# Altium schematic sheet 0039_GPP_C_D_E.SchDoc
size A3
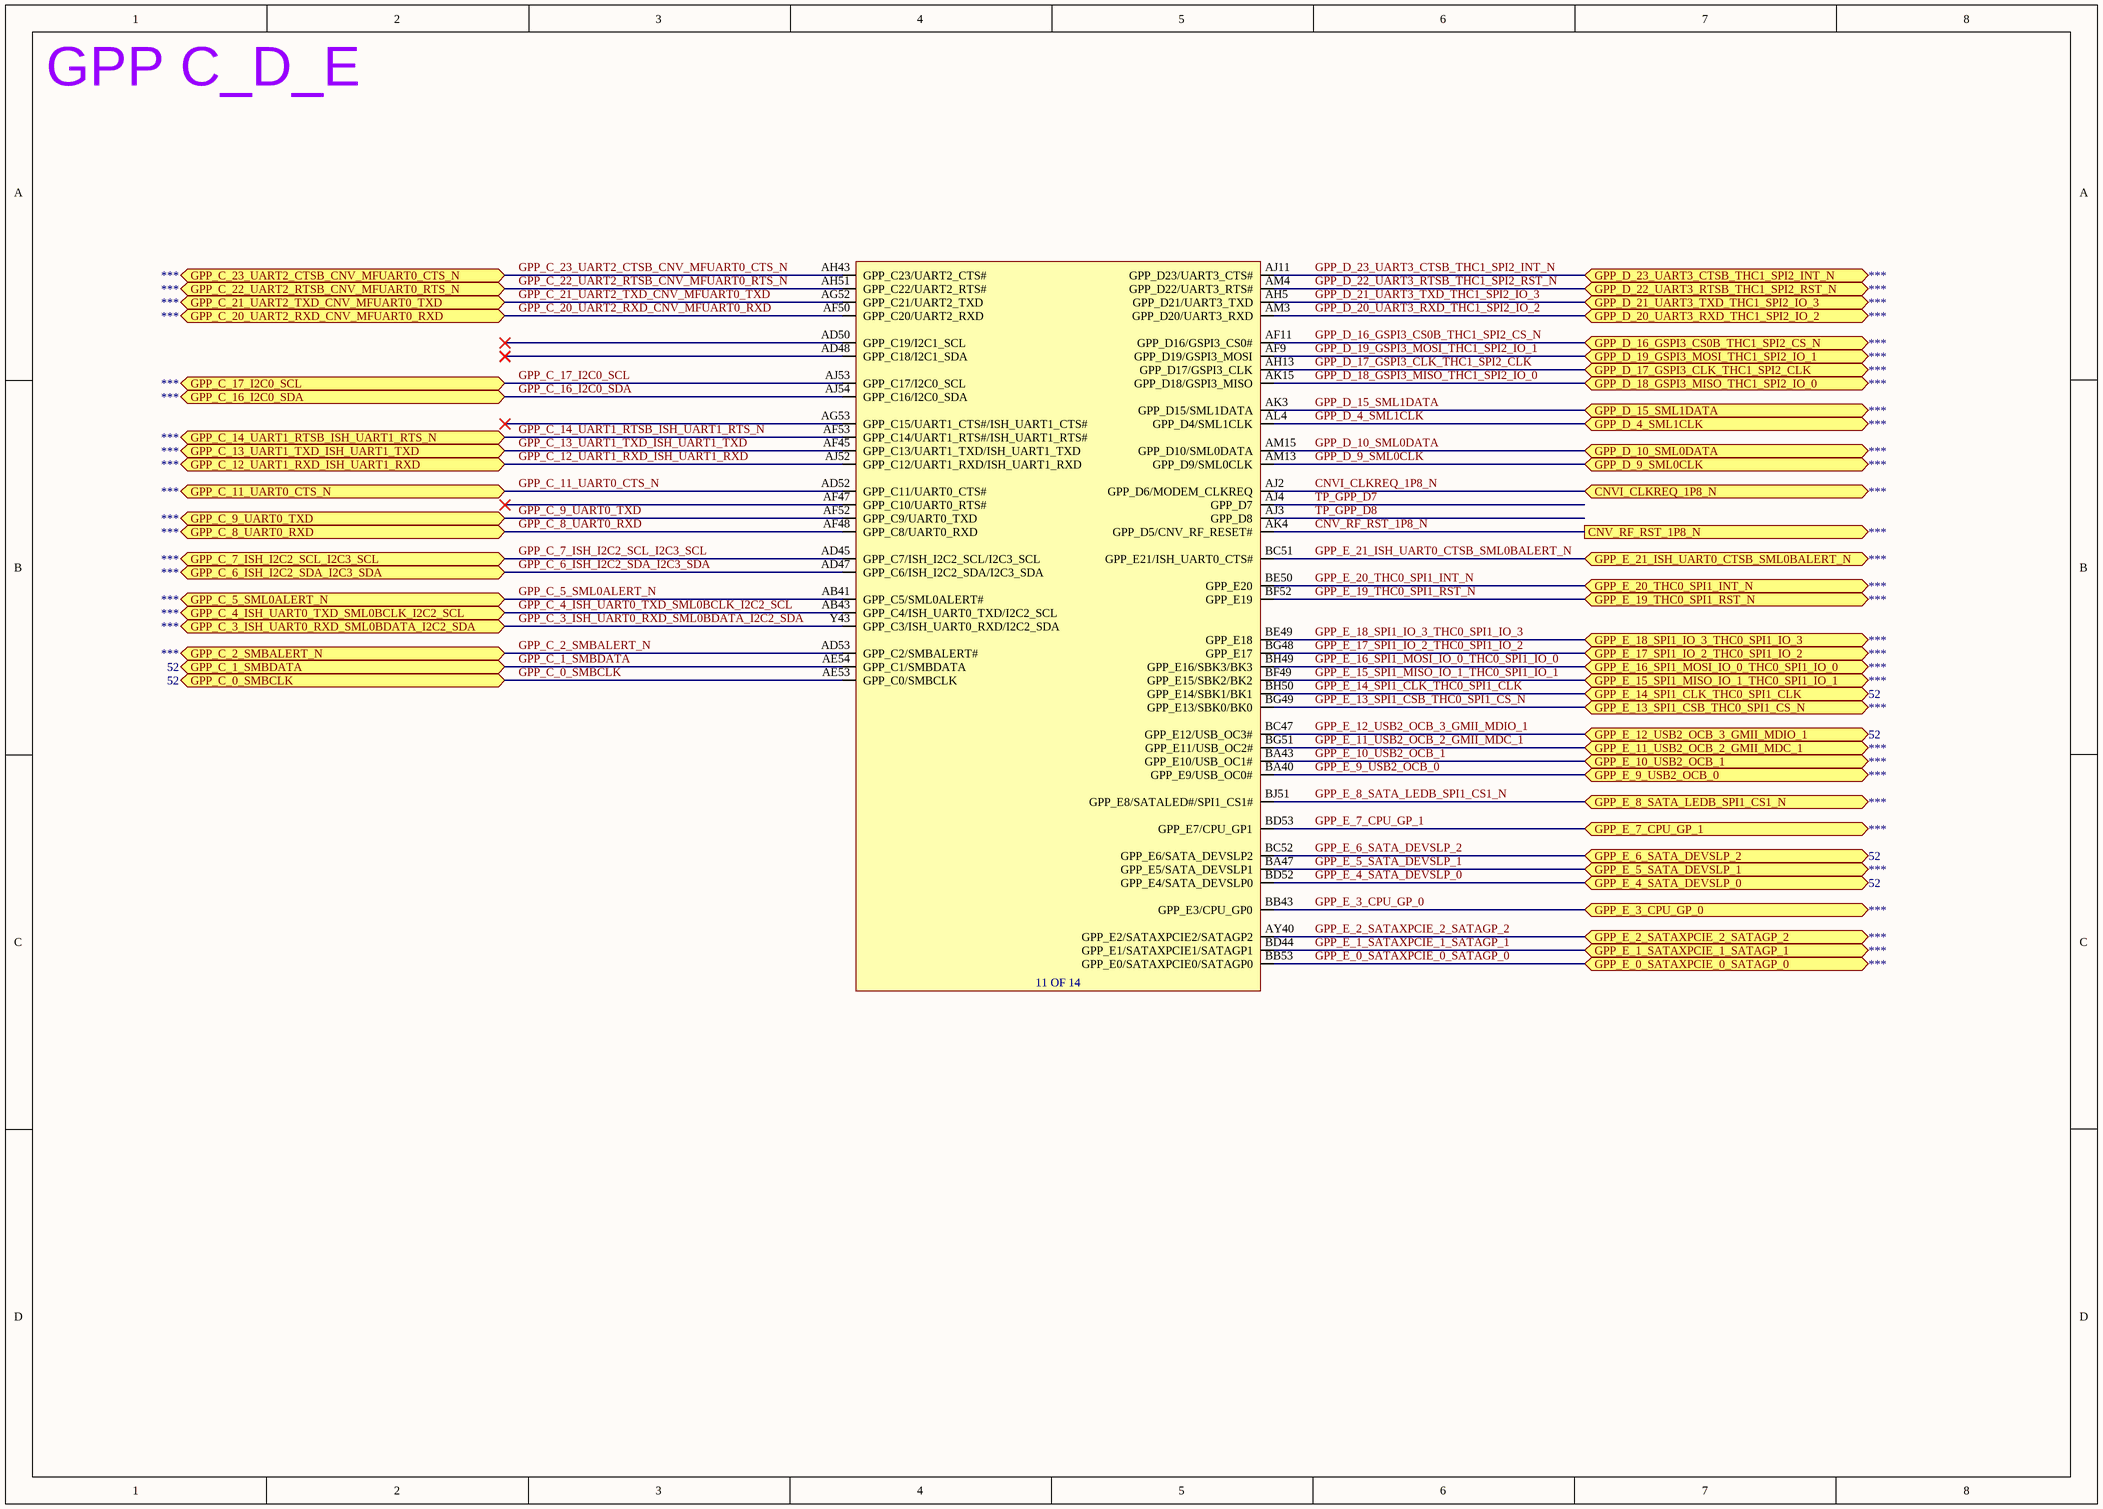
[diagram p0: 0039_GPP_C_D_E.SchDoc]

## Parts
U23601  C_RPL_S_PCH_EXT  (value not drawn)  (part K of 14)

## Ports
CNV_RF_RST_1P8_N (out), CNVI_CLKREQ_1P8_N (bidir), GPP_C_0_SMBCLK (bidir), GPP_C_1_SMBDATA (bidir), GPP_C_2_SMBALERT_N (bidir), GPP_C_3_ISH_UART0_RXD_SML0BDATA_I2C2_SDA (bidir), GPP_C_4_ISH_UART0_TXD_SML0BCLK_I2C2_SCL (bidir), GPP_C_5_SML0ALERT_N (bidir), GPP_C_6_ISH_I2C2_SDA_I2C3_SDA (bidir), GPP_C_7_ISH_I2C2_SCL_I2C3_SCL (bidir), GPP_C_8_UART0_RXD (bidir), GPP_C_9_UART0_TXD (bidir), GPP_C_11_UART0_CTS_N (bidir), GPP_C_12_UART1_RXD_ISH_UART1_RXD (bidir), GPP_C_13_UART1_TXD_ISH_UART1_TXD (bidir), GPP_C_14_UART1_RTSB_ISH_UART1_RTS_N (bidir), GPP_C_16_I2C0_SDA (bidir), GPP_C_17_I2C0_SCL (bidir), GPP_C_20_UART2_RXD_CNV_MFUART0_RXD (bidir), GPP_C_21_UART2_TXD_CNV_MFUART0_TXD (bidir), GPP_C_22_UART2_RTSB_CNV_MFUART0_RTS_N (bidir), GPP_C_23_UART2_CTSB_CNV_MFUART0_CTS_N (bidir), GPP_D_4_SML1CLK (bidir), GPP_D_9_SML0CLK (bidir), GPP_D_10_SML0DATA (bidir), GPP_D_15_SML1DATA (bidir), GPP_D_16_GSPI3_CS0B_THC1_SPI2_CS_N (bidir), GPP_D_17_GSPI3_CLK_THC1_SPI2_CLK (bidir), GPP_D_18_GSPI3_MISO_THC1_SPI2_IO_0 (bidir), GPP_D_19_GSPI3_MOSI_THC1_SPI2_IO_1 (bidir), GPP_D_20_UART3_RXD_THC1_SPI2_IO_2 (bidir), GPP_D_21_UART3_TXD_THC1_SPI2_IO_3 (bidir), GPP_D_22_UART3_RTSB_THC1_SPI2_RST_N (bidir), GPP_D_23_UART3_CTSB_THC1_SPI2_INT_N (bidir), GPP_E_0_SATAXPCIE_0_SATAGP_0 (bidir), GPP_E_1_SATAXPCIE_1_SATAGP_1 (bidir), GPP_E_2_SATAXPCIE_2_SATAGP_2 (bidir), GPP_E_3_CPU_GP_0 (bidir), GPP_E_4_SATA_DEVSLP_0 (bidir), GPP_E_5_SATA_DEVSLP_1 (bidir), GPP_E_6_SATA_DEVSLP_2 (bidir), GPP_E_7_CPU_GP_1 (bidir), GPP_E_8_SATA_LEDB_SPI1_CS1_N (bidir), GPP_E_9_USB2_OCB_0 (bidir), GPP_E_10_USB2_OCB_1 (bidir), GPP_E_11_USB2_OCB_2_GMII_MDC_1 (bidir), GPP_E_12_USB2_OCB_3_GMII_MDIO_1 (bidir), GPP_E_13_SPI1_CSB_THC0_SPI1_CS_N (bidir), GPP_E_14_SPI1_CLK_THC0_SPI1_CLK (bidir), GPP_E_15_SPI1_MISO_IO_1_THC0_SPI1_IO_1 (bidir), GPP_E_16_SPI1_MOSI_IO_0_THC0_SPI1_IO_0 (bidir), GPP_E_17_SPI1_IO_2_THC0_SPI1_IO_2 (bidir), GPP_E_18_SPI1_IO_3_THC0_SPI1_IO_3 (bidir), GPP_E_19_THC0_SPI1_RST_N (bidir), GPP_E_20_THC0_SPI1_INT_N (bidir), GPP_E_21_ISH_UART0_CTSB_SML0BALERT_N (bidir)

## Nets
CNV_RF_RST_1P8_N: U23601.AK4(GPP_D5/CNV_RF_RESET#) ; port CNV_RF_RST_1P8_N
CNVI_CLKREQ_1P8_N: U23601.AJ2(GPP_D6/MODEM_CLKREQ) ; port CNVI_CLKREQ_1P8_N
GPP_C_0_SMBCLK: U23601.AE53(GPP_C0/SMBCLK) ; port GPP_C_0_SMBCLK
GPP_C_1_SMBDATA: U23601.AE54(GPP_C1/SMBDATA) ; port GPP_C_1_SMBDATA
GPP_C_2_SMBALERT_N: U23601.AD53(GPP_C2/SMBALERT#) ; port GPP_C_2_SMBALERT_N
GPP_C_3_ISH_UART0_RXD_SML0BDATA_I2C2_SDA: U23601.Y43(GPP_C3/ISH_UART0_RXD/I2C2_SDA) ; port GPP_C_3_ISH_UART0_RXD_SML0BDATA_I2C2_SDA
GPP_C_4_ISH_UART0_TXD_SML0BCLK_I2C2_SCL: U23601.AB43(GPP_C4/ISH_UART0_TXD/I2C2_SCL) ; port GPP_C_4_ISH_UART0_TXD_SML0BCLK_I2C2_SCL
GPP_C_5_SML0ALERT_N: U23601.AB41(GPP_C5/SML0ALERT#) ; port GPP_C_5_SML0ALERT_N
GPP_C_6_ISH_I2C2_SDA_I2C3_SDA: U23601.AD47(GPP_C6/ISH_I2C2_SDA/I2C3_SDA) ; port GPP_C_6_ISH_I2C2_SDA_I2C3_SDA
GPP_C_7_ISH_I2C2_SCL_I2C3_SCL: U23601.AD45(GPP_C7/ISH_I2C2_SCL/I2C3_SCL) ; port GPP_C_7_ISH_I2C2_SCL_I2C3_SCL
GPP_C_8_UART0_RXD: U23601.AF48(GPP_C8/UART0_RXD) ; port GPP_C_8_UART0_RXD
GPP_C_9_UART0_TXD: U23601.AF52(GPP_C9/UART0_TXD) ; port GPP_C_9_UART0_TXD
GPP_C_11_UART0_CTS_N: U23601.AD52(GPP_C11/UART0_CTS#) ; port GPP_C_11_UART0_CTS_N
GPP_C_12_UART1_RXD_ISH_UART1_RXD: U23601.AJ52(GPP_C12/UART1_RXD/ISH_UART1_RXD) ; port GPP_C_12_UART1_RXD_ISH_UART1_RXD
GPP_C_13_UART1_TXD_ISH_UART1_TXD: U23601.AF45(GPP_C13/UART1_TXD/ISH_UART1_TXD) ; port GPP_C_13_UART1_TXD_ISH_UART1_TXD
GPP_C_14_UART1_RTSB_ISH_UART1_RTS_N: U23601.AF53(GPP_C14/UART1_RTS#/ISH_UART1_RTS#) ; port GPP_C_14_UART1_RTSB_ISH_UART1_RTS_N
GPP_C_16_I2C0_SDA: U23601.AJ54(GPP_C16/I2C0_SDA) ; port GPP_C_16_I2C0_SDA
GPP_C_17_I2C0_SCL: U23601.AJ53(GPP_C17/I2C0_SCL) ; port GPP_C_17_I2C0_SCL
GPP_C_20_UART2_RXD_CNV_MFUART0_RXD: U23601.AF50(GPP_C20/UART2_RXD) ; port GPP_C_20_UART2_RXD_CNV_MFUART0_RXD
GPP_C_21_UART2_TXD_CNV_MFUART0_TXD: U23601.AG52(GPP_C21/UART2_TXD) ; port GPP_C_21_UART2_TXD_CNV_MFUART0_TXD
GPP_C_22_UART2_RTSB_CNV_MFUART0_RTS_N: U23601.AH51(GPP_C22/UART2_RTS#) ; port GPP_C_22_UART2_RTSB_CNV_MFUART0_RTS_N
GPP_C_23_UART2_CTSB_CNV_MFUART0_CTS_N: U23601.AH43(GPP_C23/UART2_CTS#) ; port GPP_C_23_UART2_CTSB_CNV_MFUART0_CTS_N
GPP_D_4_SML1CLK: U23601.AL4(GPP_D4/SML1CLK) ; port GPP_D_4_SML1CLK
GPP_D_9_SML0CLK: U23601.AM13(GPP_D9/SML0CLK) ; port GPP_D_9_SML0CLK
GPP_D_10_SML0DATA: U23601.AM15(GPP_D10/SML0DATA) ; port GPP_D_10_SML0DATA
GPP_D_15_SML1DATA: U23601.AK3(GPP_D15/SML1DATA) ; port GPP_D_15_SML1DATA
GPP_D_16_GSPI3_CS0B_THC1_SPI2_CS_N: U23601.AF11(GPP_D16/GSPI3_CS0#) ; port GPP_D_16_GSPI3_CS0B_THC1_SPI2_CS_N
GPP_D_17_GSPI3_CLK_THC1_SPI2_CLK: U23601.AH13(GPP_D17/GSPI3_CLK) ; port GPP_D_17_GSPI3_CLK_THC1_SPI2_CLK
GPP_D_18_GSPI3_MISO_THC1_SPI2_IO_0: U23601.AK15(GPP_D18/GSPI3_MISO) ; port GPP_D_18_GSPI3_MISO_THC1_SPI2_IO_0
GPP_D_19_GSPI3_MOSI_THC1_SPI2_IO_1: U23601.AF9(GPP_D19/GSPI3_MOSI) ; port GPP_D_19_GSPI3_MOSI_THC1_SPI2_IO_1
GPP_D_20_UART3_RXD_THC1_SPI2_IO_2: U23601.AM3(GPP_D20/UART3_RXD) ; port GPP_D_20_UART3_RXD_THC1_SPI2_IO_2
GPP_D_21_UART3_TXD_THC1_SPI2_IO_3: U23601.AH5(GPP_D21/UART3_TXD) ; port GPP_D_21_UART3_TXD_THC1_SPI2_IO_3
GPP_D_22_UART3_RTSB_THC1_SPI2_RST_N: U23601.AM4(GPP_D22/UART3_RTS#) ; port GPP_D_22_UART3_RTSB_THC1_SPI2_RST_N
GPP_D_23_UART3_CTSB_THC1_SPI2_INT_N: U23601.AJ11(GPP_D23/UART3_CTS#) ; port GPP_D_23_UART3_CTSB_THC1_SPI2_INT_N
GPP_E_0_SATAXPCIE_0_SATAGP_0: U23601.BB53(GPP_E0/SATAXPCIE0/SATAGP0) ; port GPP_E_0_SATAXPCIE_0_SATAGP_0
GPP_E_1_SATAXPCIE_1_SATAGP_1: U23601.BD44(GPP_E1/SATAXPCIE1/SATAGP1) ; port GPP_E_1_SATAXPCIE_1_SATAGP_1
GPP_E_2_SATAXPCIE_2_SATAGP_2: U23601.AY40(GPP_E2/SATAXPCIE2/SATAGP2) ; port GPP_E_2_SATAXPCIE_2_SATAGP_2
GPP_E_3_CPU_GP_0: U23601.BB43(GPP_E3/CPU_GP0) ; port GPP_E_3_CPU_GP_0
GPP_E_4_SATA_DEVSLP_0: U23601.BD52(GPP_E4/SATA_DEVSLP0) ; port GPP_E_4_SATA_DEVSLP_0
GPP_E_5_SATA_DEVSLP_1: U23601.BA47(GPP_E5/SATA_DEVSLP1) ; port GPP_E_5_SATA_DEVSLP_1
GPP_E_6_SATA_DEVSLP_2: U23601.BC52(GPP_E6/SATA_DEVSLP2) ; port GPP_E_6_SATA_DEVSLP_2
GPP_E_7_CPU_GP_1: U23601.BD53(GPP_E7/CPU_GP1) ; port GPP_E_7_CPU_GP_1
GPP_E_8_SATA_LEDB_SPI1_CS1_N: U23601.BJ51(GPP_E8/SATALED#/SPI1_CS1#) ; port GPP_E_8_SATA_LEDB_SPI1_CS1_N
GPP_E_9_USB2_OCB_0: U23601.BA40(GPP_E9/USB_OC0#) ; port GPP_E_9_USB2_OCB_0
GPP_E_10_USB2_OCB_1: U23601.BA43(GPP_E10/USB_OC1#) ; port GPP_E_10_USB2_OCB_1
GPP_E_11_USB2_OCB_2_GMII_MDC_1: U23601.BG51(GPP_E11/USB_OC2#) ; port GPP_E_11_USB2_OCB_2_GMII_MDC_1
GPP_E_12_USB2_OCB_3_GMII_MDIO_1: U23601.BC47(GPP_E12/USB_OC3#) ; port GPP_E_12_USB2_OCB_3_GMII_MDIO_1
GPP_E_13_SPI1_CSB_THC0_SPI1_CS_N: U23601.BG49(GPP_E13/SBK0/BK0) ; port GPP_E_13_SPI1_CSB_THC0_SPI1_CS_N
GPP_E_14_SPI1_CLK_THC0_SPI1_CLK: U23601.BH50(GPP_E14/SBK1/BK1) ; port GPP_E_14_SPI1_CLK_THC0_SPI1_CLK
GPP_E_15_SPI1_MISO_IO_1_THC0_SPI1_IO_1: U23601.BF49(GPP_E15/SBK2/BK2) ; port GPP_E_15_SPI1_MISO_IO_1_THC0_SPI1_IO_1
GPP_E_16_SPI1_MOSI_IO_0_THC0_SPI1_IO_0: U23601.BH49(GPP_E16/SBK3/BK3) ; port GPP_E_16_SPI1_MOSI_IO_0_THC0_SPI1_IO_0
GPP_E_17_SPI1_IO_2_THC0_SPI1_IO_2: U23601.BG48(GPP_E17) ; port GPP_E_17_SPI1_IO_2_THC0_SPI1_IO_2
GPP_E_18_SPI1_IO_3_THC0_SPI1_IO_3: U23601.BE49(GPP_E18) ; port GPP_E_18_SPI1_IO_3_THC0_SPI1_IO_3
GPP_E_19_THC0_SPI1_RST_N: U23601.BF52(GPP_E19) ; port GPP_E_19_THC0_SPI1_RST_N
GPP_E_20_THC0_SPI1_INT_N: U23601.BE50(GPP_E20) ; port GPP_E_20_THC0_SPI1_INT_N
GPP_E_21_ISH_UART0_CTSB_SML0BALERT_N: U23601.BC51(GPP_E21/ISH_UART0_CTS#) ; port GPP_E_21_ISH_UART0_CTSB_SML0BALERT_N
TP_GPP_D7: U23601.AJ4(GPP_D7)
TP_GPP_D8: U23601.AJ3(GPP_D8)

Not connected (* = marked no-connect by the designer): U23601 AD48(GPP_C18/I2C1_SDA)* AD50(GPP_C19/I2C1_SCL)* AF47(GPP_C10/UART0_RTS#)* AG53(GPP_C15/UART1_CTS#/ISH_UART1_CTS#)*

## Notes on the sheet
- GPP C_D_E
- (in symbol C_RPL_S_PCH_EXT, part K) 11 OF 14

## Library data of the parts
U23601 = C_RPL_S_PCH_EXT: Manufacturer Part Number: *; Case/Package: *